# EAGLE design main (EAGLE 6.1)
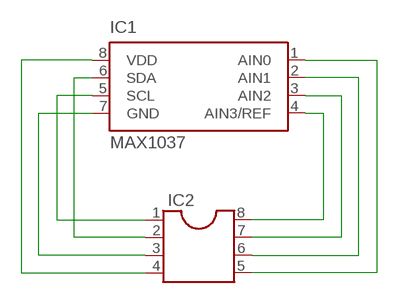
[diagram p0: schematic, sheet 1]

## Parts
IC1  MAX1037  [SOT23-8L]
IC2  DIL8  [DIL08]

## Nets
N$1: IC1.4(AIN3/REF) IC2.8
N$2: IC1.3(AIN2) IC2.7
N$3: IC1.2(AIN1) IC2.6
N$4: IC1.1(AIN0) IC2.5
N$5: IC1.8(VDD) IC2.4
N$6: IC1.7(GND) IC2.3
N$7: IC1.5(SCL) IC2.1
N$8: IC1.6(SDA) IC2.2

## Library data of the parts
IC1 = maxim:MAX103*: 2.7V to 5.5V, Low-Power, 4-/12-Channel 2-Wire Serial 8-Bit ADCs Source: http://datasheets.maxim-ic.com/en/ds/MAX1036-MAX1039M.pdf; MF: MAXIM; MPN: MAX1037EKA+T; OC_FARNELL: unknown; OC_NEWARK: 68K9410
IC2 = ic-package:DIL8: Dual In Line / Socket

## Board
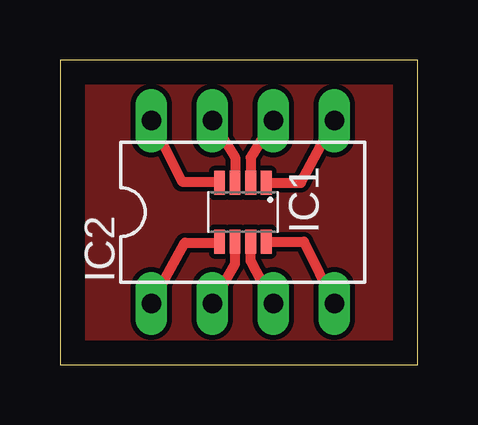
[diagram p1: board, top side]

Size 14.91 x 12.69 mm. Coordinates in mm from the lower left corner, seen from the top.
Outline: 0,0 14.91,0 14.91,12.69 0,12.69 0,0
Copper layers (1*16): Top 0.035mm / dielectric 1.5mm / Bottom 0.035mm
Design rules: minimum track width 10mil, minimum drill 24mil, track to track 8mil, track to pad 8mil, pad to pad 8mil, via to via 8mil, smd to smd 8mil, copper to edge 40mil, drill to drill 8mil, minimum pad ring 10mil, minimum via ring 8mil, stop-mask expansion 4mil, vias tented up to drill 0mil, thermal gap 10mil

### Footprints (pad centres in the part's own frame; a part is rotated, then mirrored left to right if it is on the bottom)
SOT23-8L = smd 0.45 x 1: 1 -0.975,-1.225; 2 -0.325,-1.225; 3 0.325,-1.225; 4 0.975,-1.225; 5 0.975,1.225; 6 0.325,1.225; 7 -0.325,1.225; 8 -0.975,1.225
DIL08 = drill 0.813 long: 1 -3.81,-3.81; 2 -1.27,-3.81; 3 1.27,-3.81; 4 3.81,-3.81; 5 3.81,3.81; 6 1.27,3.81; 7 -1.27,3.81; 8 -3.81,3.81

### Placement (x,y rotation side)
IC1  7.62,6.35 180 top
IC2  7.62,6.35 0 top

### Tracks (layer width: path | path; a pad name or v marks a point on that pad's centre or on a via)
N$1
  Top 0.406: IC2.8 5.08,7.62 6.64,7.62 IC1.4
N$2
  Top 0.406: IC2.7 7.29,8.64 IC1.3
N$3
  Top 0.406: IC2.6 7.95,8.64 IC1.2
N$4
  Top 0.406: IC1.1 10.03,7.57 IC2.5
N$5
  Top 0.406: IC1.8 10.16,5.12 IC2.4
N$6
  Top 0.406: IC2.3 7.95,4.32 IC1.7
N$7
  Top 0.406: IC2.1 5.21,5.08 6.64,5.08 IC1.5
N$8
  Top 0.406: IC2.2 7.29,4.19 IC1.6
N$9
  pour Top: 0,12.7 14.86,12.7 14.86,0 0,0